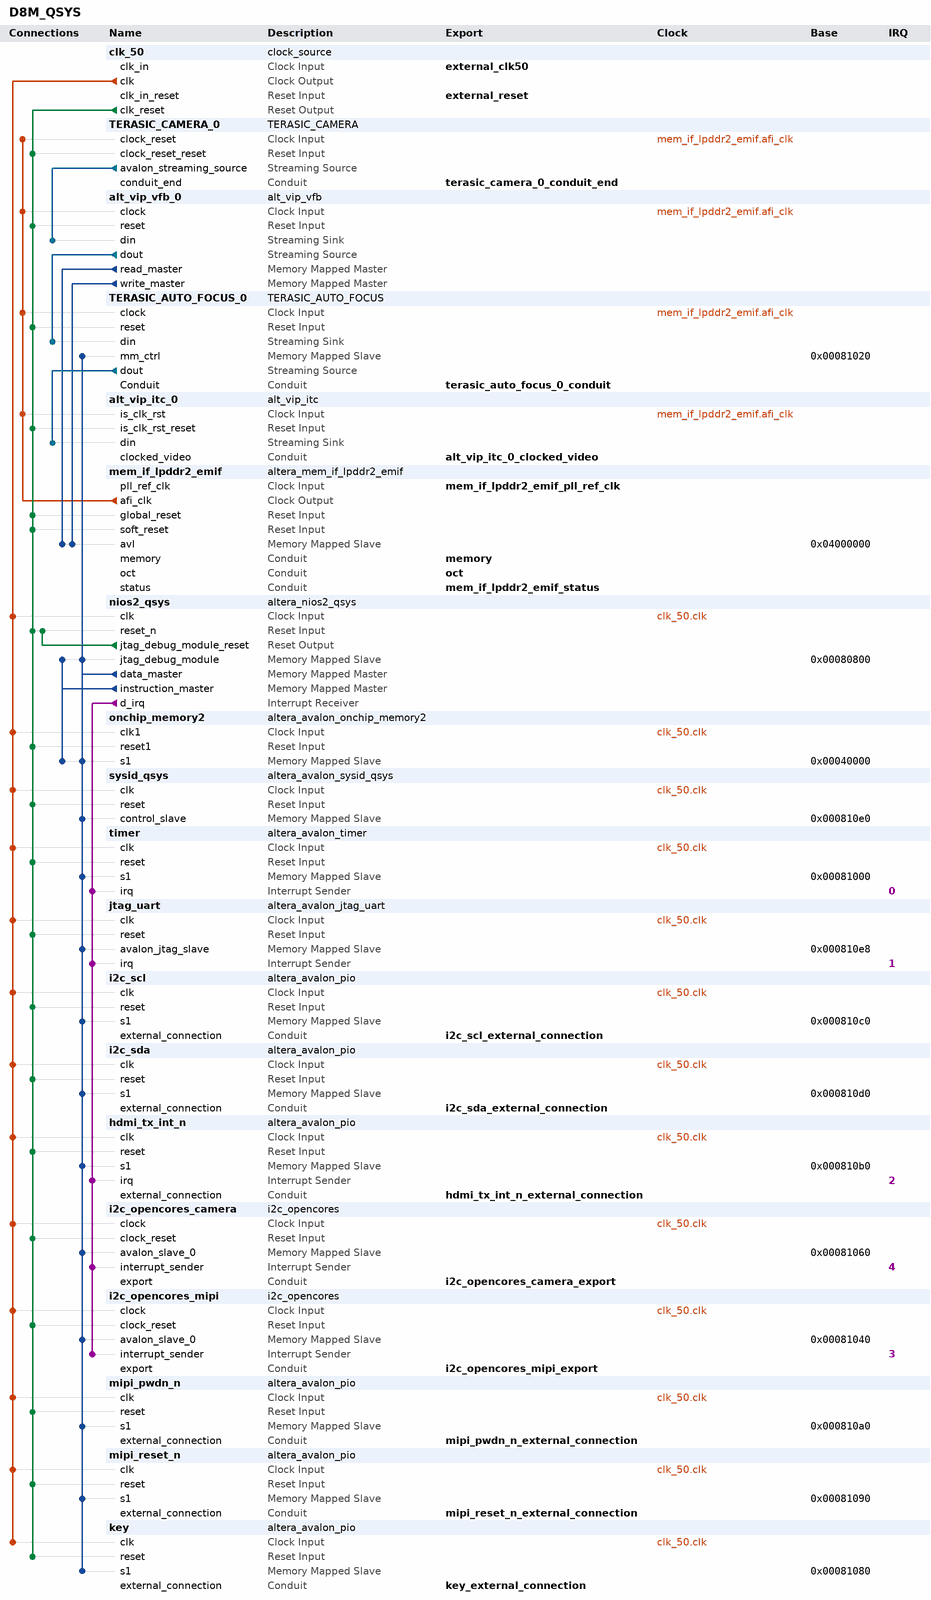
[diagram p0: system contents]
# Platform Designer (Qsys) system D8M_QSYS, Cyclone V 5CGXFC5C6F27C7
# Parameters at their usual value, and those the tool derives, are not listed.
package require -exact qsys 15.0
create_system D8M_QSYS
set_project_property DEVICE_FAMILY {Cyclone V}
set_project_property DEVICE 5CGXFC5C6F27C7

add_instance clk_50 clock_source 15.0
set_instance_parameter_value clk_50 clockFrequency 50000000

add_instance TERASIC_CAMERA_0 TERASIC_CAMERA 1.0
set_instance_parameter_value TERASIC_CAMERA_0 VIDEO_H 1080
set_instance_parameter_value TERASIC_CAMERA_0 VIDEO_W 1920

add_instance alt_vip_vfb_0 alt_vip_vfb 13.1

add_instance TERASIC_AUTO_FOCUS_0 TERASIC_AUTO_FOCUS 1.0
set_instance_parameter_value TERASIC_AUTO_FOCUS_0 VIDEO_H 1080
set_instance_parameter_value TERASIC_AUTO_FOCUS_0 VIDEO_W 1920

add_instance alt_vip_itc_0 alt_vip_itc 14.0
set_instance_parameter_value alt_vip_itc_0 FIFO_DEPTH 3840
set_instance_parameter_value alt_vip_itc_0 H_ACTIVE_PIXELS 1920
set_instance_parameter_value alt_vip_itc_0 H_BACK_PORCH 148
set_instance_parameter_value alt_vip_itc_0 H_FRONT_PORCH 88
set_instance_parameter_value alt_vip_itc_0 H_SYNC_LENGTH 44
set_instance_parameter_value alt_vip_itc_0 NUMBER_OF_COLOUR_PLANES 3
set_instance_parameter_value alt_vip_itc_0 THRESHOLD 1919
set_instance_parameter_value alt_vip_itc_0 V_ACTIVE_LINES 1080
set_instance_parameter_value alt_vip_itc_0 V_BACK_PORCH 36
set_instance_parameter_value alt_vip_itc_0 V_FRONT_PORCH 4
set_instance_parameter_value alt_vip_itc_0 V_SYNC_LENGTH 5

add_instance mem_if_lpddr2_emif altera_mem_if_lpddr2_emif 15.0
set_instance_parameter_value mem_if_lpddr2_emif ABSTRACT_REAL_COMPARE_TEST false
set_instance_parameter_value mem_if_lpddr2_emif ABS_RAM_MEM_INIT_FILENAME meminit
set_instance_parameter_value mem_if_lpddr2_emif ACV_PHY_CLK_ADD_FR_PHASE 0.0
set_instance_parameter_value mem_if_lpddr2_emif AC_PACKAGE_DESKEW false
set_instance_parameter_value mem_if_lpddr2_emif AC_ROM_USER_ADD_0 0_0000_0000_0000
set_instance_parameter_value mem_if_lpddr2_emif AC_ROM_USER_ADD_1 0_0000_0000_1000
set_instance_parameter_value mem_if_lpddr2_emif ADDR_ORDER 0
set_instance_parameter_value mem_if_lpddr2_emif ADD_EFFICIENCY_MONITOR false
set_instance_parameter_value mem_if_lpddr2_emif ADD_EXTERNAL_SEQ_DEBUG_NIOS false
set_instance_parameter_value mem_if_lpddr2_emif ADVANCED_CK_PHASES false
set_instance_parameter_value mem_if_lpddr2_emif ADVERTIZE_SEQUENCER_SW_BUILD_FILES false
set_instance_parameter_value mem_if_lpddr2_emif AFI_DEBUG_INFO_WIDTH 32
set_instance_parameter_value mem_if_lpddr2_emif ALTMEMPHY_COMPATIBLE_MODE false
set_instance_parameter_value mem_if_lpddr2_emif AP_MODE false
set_instance_parameter_value mem_if_lpddr2_emif AP_MODE_EN 0
set_instance_parameter_value mem_if_lpddr2_emif AVL_DATA_WIDTH_PORT 32,32,32,32,32,32
set_instance_parameter_value mem_if_lpddr2_emif AVL_MAX_SIZE 32
set_instance_parameter_value mem_if_lpddr2_emif BYTE_ENABLE true
set_instance_parameter_value mem_if_lpddr2_emif C2P_WRITE_CLOCK_ADD_PHASE 0.0
set_instance_parameter_value mem_if_lpddr2_emif CALIBRATION_MODE Skip
set_instance_parameter_value mem_if_lpddr2_emif CALIB_REG_WIDTH 8
set_instance_parameter_value mem_if_lpddr2_emif CFG_DATA_REORDERING_TYPE INTER_BANK
set_instance_parameter_value mem_if_lpddr2_emif CFG_REORDER_DATA true
set_instance_parameter_value mem_if_lpddr2_emif CFG_TCCD_NS 2.5
set_instance_parameter_value mem_if_lpddr2_emif COMMAND_PHASE 0.0
set_instance_parameter_value mem_if_lpddr2_emif CONTROLLER_LATENCY 5
set_instance_parameter_value mem_if_lpddr2_emif CORE_DEBUG_CONNECTION EXPORT
set_instance_parameter_value mem_if_lpddr2_emif CPORT_TYPE_PORT Write-only,Read-only,Bidirectional,Bidirectional,Bidirectional,Bidirectional
set_instance_parameter_value mem_if_lpddr2_emif CTL_AUTOPCH_EN false
set_instance_parameter_value mem_if_lpddr2_emif CTL_CMD_QUEUE_DEPTH 8
set_instance_parameter_value mem_if_lpddr2_emif CTL_CSR_CONNECTION INTERNAL_JTAG
set_instance_parameter_value mem_if_lpddr2_emif CTL_CSR_ENABLED false
set_instance_parameter_value mem_if_lpddr2_emif CTL_CSR_READ_ONLY 1
set_instance_parameter_value mem_if_lpddr2_emif CTL_DEEP_POWERDN_EN false
set_instance_parameter_value mem_if_lpddr2_emif CTL_DYNAMIC_BANK_ALLOCATION false
set_instance_parameter_value mem_if_lpddr2_emif CTL_DYNAMIC_BANK_NUM 4
set_instance_parameter_value mem_if_lpddr2_emif CTL_ECC_AUTO_CORRECTION_ENABLED false
set_instance_parameter_value mem_if_lpddr2_emif CTL_ECC_ENABLED false
set_instance_parameter_value mem_if_lpddr2_emif CTL_ENABLE_BURST_INTERRUPT false
set_instance_parameter_value mem_if_lpddr2_emif CTL_ENABLE_BURST_TERMINATE false
set_instance_parameter_value mem_if_lpddr2_emif CTL_HRB_ENABLED false
set_instance_parameter_value mem_if_lpddr2_emif CTL_LOOK_AHEAD_DEPTH 4
set_instance_parameter_value mem_if_lpddr2_emif CTL_SELF_REFRESH_EN false
set_instance_parameter_value mem_if_lpddr2_emif CTL_USR_REFRESH_EN false
set_instance_parameter_value mem_if_lpddr2_emif CTL_ZQCAL_EN false
set_instance_parameter_value mem_if_lpddr2_emif CUT_NEW_FAMILY_TIMING true
set_instance_parameter_value mem_if_lpddr2_emif DAT_DATA_WIDTH 32
set_instance_parameter_value mem_if_lpddr2_emif DEBUG_MODE false
set_instance_parameter_value mem_if_lpddr2_emif DEVICE_DEPTH 1
set_instance_parameter_value mem_if_lpddr2_emif DISABLE_CHILD_MESSAGING false
set_instance_parameter_value mem_if_lpddr2_emif DISCRETE_FLY_BY true
set_instance_parameter_value mem_if_lpddr2_emif DLL_SHARING_MODE None
set_instance_parameter_value mem_if_lpddr2_emif DQS_DQSN_MODE DIFFERENTIAL
set_instance_parameter_value mem_if_lpddr2_emif DQ_INPUT_REG_USE_CLKN false
set_instance_parameter_value mem_if_lpddr2_emif DUPLICATE_AC false
set_instance_parameter_value mem_if_lpddr2_emif ED_EXPORT_SEQ_DEBUG false
set_instance_parameter_value mem_if_lpddr2_emif ENABLE_ABS_RAM_MEM_INIT false
set_instance_parameter_value mem_if_lpddr2_emif ENABLE_BONDING false
set_instance_parameter_value mem_if_lpddr2_emif ENABLE_BURST_MERGE false
set_instance_parameter_value mem_if_lpddr2_emif ENABLE_CTRL_AVALON_INTERFACE true
set_instance_parameter_value mem_if_lpddr2_emif ENABLE_DELAY_CHAIN_WRITE false
set_instance_parameter_value mem_if_lpddr2_emif ENABLE_EMIT_BFM_MASTER false
set_instance_parameter_value mem_if_lpddr2_emif ENABLE_EXPORT_SEQ_DEBUG_BRIDGE false
set_instance_parameter_value mem_if_lpddr2_emif ENABLE_EXTRA_REPORTING false
set_instance_parameter_value mem_if_lpddr2_emif ENABLE_ISS_PROBES false
set_instance_parameter_value mem_if_lpddr2_emif ENABLE_NON_DESTRUCTIVE_CALIB false
set_instance_parameter_value mem_if_lpddr2_emif ENABLE_NON_DES_CAL false
set_instance_parameter_value mem_if_lpddr2_emif ENABLE_NON_DES_CAL_TEST false
set_instance_parameter_value mem_if_lpddr2_emif ENABLE_SEQUENCER_MARGINING_ON_BY_DEFAULT false
set_instance_parameter_value mem_if_lpddr2_emif ENABLE_USER_ECC false
set_instance_parameter_value mem_if_lpddr2_emif EXPORT_AFI_HALF_CLK false
set_instance_parameter_value mem_if_lpddr2_emif FORCED_NON_LDC_ADDR_CMD_MEM_CK_INVERT false
set_instance_parameter_value mem_if_lpddr2_emif FORCED_NUM_WRITE_FR_CYCLE_SHIFTS 0
set_instance_parameter_value mem_if_lpddr2_emif FORCE_DQS_TRACKING AUTO
set_instance_parameter_value mem_if_lpddr2_emif FORCE_MAX_LATENCY_COUNT_WIDTH 0
set_instance_parameter_value mem_if_lpddr2_emif FORCE_SEQUENCER_TCL_DEBUG_MODE false
set_instance_parameter_value mem_if_lpddr2_emif FORCE_SHADOW_REGS AUTO
set_instance_parameter_value mem_if_lpddr2_emif HARD_EMIF false
set_instance_parameter_value mem_if_lpddr2_emif HCX_COMPAT_MODE false
set_instance_parameter_value mem_if_lpddr2_emif HHP_HPS false
set_instance_parameter_value mem_if_lpddr2_emif HHP_HPS_SIMULATION false
set_instance_parameter_value mem_if_lpddr2_emif HHP_HPS_VERIFICATION false
set_instance_parameter_value mem_if_lpddr2_emif HPS_PROTOCOL DEFAULT
set_instance_parameter_value mem_if_lpddr2_emif INCLUDE_BOARD_DELAY_MODEL false
set_instance_parameter_value mem_if_lpddr2_emif INCLUDE_MULTIRANK_BOARD_DELAY_MODEL false
set_instance_parameter_value mem_if_lpddr2_emif IS_ES_DEVICE false
set_instance_parameter_value mem_if_lpddr2_emif LOCAL_ID_WIDTH 8
set_instance_parameter_value mem_if_lpddr2_emif MARGIN_VARIATION_TEST false
set_instance_parameter_value mem_if_lpddr2_emif MAX_PENDING_RD_CMD 16
set_instance_parameter_value mem_if_lpddr2_emif MAX_PENDING_WR_CMD 8
set_instance_parameter_value mem_if_lpddr2_emif MEM_ATCL 0
set_instance_parameter_value mem_if_lpddr2_emif MEM_AUTO_LEVELING_MODE true
set_instance_parameter_value mem_if_lpddr2_emif MEM_BANKADDR_WIDTH 2
set_instance_parameter_value mem_if_lpddr2_emif MEM_BL 8
set_instance_parameter_value mem_if_lpddr2_emif MEM_BT Sequential
set_instance_parameter_value mem_if_lpddr2_emif MEM_CK_PHASE 0.0
set_instance_parameter_value mem_if_lpddr2_emif MEM_CK_WIDTH 1
set_instance_parameter_value mem_if_lpddr2_emif MEM_CLK_EN_WIDTH 1
set_instance_parameter_value mem_if_lpddr2_emif MEM_CLK_FREQ 300.0
set_instance_parameter_value mem_if_lpddr2_emif MEM_CLK_FREQ_MAX 400.0
set_instance_parameter_value mem_if_lpddr2_emif MEM_COL_ADDR_WIDTH 9
set_instance_parameter_value mem_if_lpddr2_emif MEM_CS_WIDTH 1
set_instance_parameter_value mem_if_lpddr2_emif MEM_DEVICE MISSING_MODEL
set_instance_parameter_value mem_if_lpddr2_emif MEM_DLL_EN true
set_instance_parameter_value mem_if_lpddr2_emif MEM_DQ_PER_DQS 8
set_instance_parameter_value mem_if_lpddr2_emif MEM_DQ_WIDTH 32
set_instance_parameter_value mem_if_lpddr2_emif MEM_DRV_STR 40
set_instance_parameter_value mem_if_lpddr2_emif MEM_FORMAT DISCRETE
set_instance_parameter_value mem_if_lpddr2_emif MEM_GUARANTEED_WRITE_INIT false
set_instance_parameter_value mem_if_lpddr2_emif MEM_IF_BOARD_BASE_DELAY 10
set_instance_parameter_value mem_if_lpddr2_emif MEM_IF_DM_PINS_EN true
set_instance_parameter_value mem_if_lpddr2_emif MEM_IF_DQSN_EN true
set_instance_parameter_value mem_if_lpddr2_emif MEM_IF_SIM_VALID_WINDOW 0
set_instance_parameter_value mem_if_lpddr2_emif MEM_INIT_EN false
set_instance_parameter_value mem_if_lpddr2_emif MEM_MIRROR_ADDRESSING 0
set_instance_parameter_value mem_if_lpddr2_emif MEM_NUMBER_OF_DIMMS 1
set_instance_parameter_value mem_if_lpddr2_emif MEM_NUMBER_OF_RANKS_PER_DEVICE 1
set_instance_parameter_value mem_if_lpddr2_emif MEM_NUMBER_OF_RANKS_PER_DIMM 1
set_instance_parameter_value mem_if_lpddr2_emif MEM_RANK_MULTIPLICATION_FACTOR 1
set_instance_parameter_value mem_if_lpddr2_emif MEM_ROW_ADDR_WIDTH 13
set_instance_parameter_value mem_if_lpddr2_emif MEM_TCL 7
set_instance_parameter_value mem_if_lpddr2_emif MEM_TFAW_NS 50.0
set_instance_parameter_value mem_if_lpddr2_emif MEM_TINIT_US 200
set_instance_parameter_value mem_if_lpddr2_emif MEM_TMRD_CK 5
set_instance_parameter_value mem_if_lpddr2_emif MEM_TRAS_NS 70.0
set_instance_parameter_value mem_if_lpddr2_emif MEM_TRCD_NS 18.0
set_instance_parameter_value mem_if_lpddr2_emif MEM_TREFI_US 7.8
set_instance_parameter_value mem_if_lpddr2_emif MEM_TRFC_NS 130.0
set_instance_parameter_value mem_if_lpddr2_emif MEM_TRP_NS 18.0
set_instance_parameter_value mem_if_lpddr2_emif MEM_TRRD_NS 10.0
set_instance_parameter_value mem_if_lpddr2_emif MEM_TRTP_NS 7.5
set_instance_parameter_value mem_if_lpddr2_emif MEM_TWR_NS 15.0
set_instance_parameter_value mem_if_lpddr2_emif MEM_TWTR 3
set_instance_parameter_value mem_if_lpddr2_emif MEM_USER_LEVELING_MODE Leveling
set_instance_parameter_value mem_if_lpddr2_emif MEM_VENDOR Micron
set_instance_parameter_value mem_if_lpddr2_emif MEM_VERBOSE true
set_instance_parameter_value mem_if_lpddr2_emif MRS_MIRROR_PING_PONG_ATSO false
set_instance_parameter_value mem_if_lpddr2_emif MULTICAST_EN false
set_instance_parameter_value mem_if_lpddr2_emif NEXTGEN true
set_instance_parameter_value mem_if_lpddr2_emif NIOS_ROM_DATA_WIDTH 32
set_instance_parameter_value mem_if_lpddr2_emif NUM_DLL_SHARING_INTERFACES 1
set_instance_parameter_value mem_if_lpddr2_emif NUM_EXTRA_REPORT_PATH 10
set_instance_parameter_value mem_if_lpddr2_emif NUM_OCT_SHARING_INTERFACES 1
set_instance_parameter_value mem_if_lpddr2_emif NUM_OF_PORTS 1
set_instance_parameter_value mem_if_lpddr2_emif NUM_PLL_SHARING_INTERFACES 1
set_instance_parameter_value mem_if_lpddr2_emif OCT_SHARING_MODE None
set_instance_parameter_value mem_if_lpddr2_emif P2C_READ_CLOCK_ADD_PHASE 0.0
set_instance_parameter_value mem_if_lpddr2_emif PACKAGE_DESKEW false
set_instance_parameter_value mem_if_lpddr2_emif PARSE_FRIENDLY_DEVICE_FAMILY_PARAM_VALID false
set_instance_parameter_value mem_if_lpddr2_emif PHY_CSR_CONNECTION INTERNAL_JTAG
set_instance_parameter_value mem_if_lpddr2_emif PHY_CSR_ENABLED false
set_instance_parameter_value mem_if_lpddr2_emif PHY_ONLY false
set_instance_parameter_value mem_if_lpddr2_emif PINGPONGPHY_EN false
set_instance_parameter_value mem_if_lpddr2_emif PLL_ADDR_CMD_CLK_DIV_PARAM 0
set_instance_parameter_value mem_if_lpddr2_emif PLL_ADDR_CMD_CLK_FREQ_PARAM 0.0
set_instance_parameter_value mem_if_lpddr2_emif PLL_ADDR_CMD_CLK_MULT_PARAM 0
set_instance_parameter_value mem_if_lpddr2_emif PLL_ADDR_CMD_CLK_PHASE_PS_PARAM 0
set_instance_parameter_value mem_if_lpddr2_emif PLL_AFI_CLK_DIV_PARAM 0
set_instance_parameter_value mem_if_lpddr2_emif PLL_AFI_CLK_FREQ_PARAM 0.0
set_instance_parameter_value mem_if_lpddr2_emif PLL_AFI_CLK_MULT_PARAM 0
set_instance_parameter_value mem_if_lpddr2_emif PLL_AFI_CLK_PHASE_PS_PARAM 0
set_instance_parameter_value mem_if_lpddr2_emif PLL_AFI_HALF_CLK_DIV_PARAM 0
set_instance_parameter_value mem_if_lpddr2_emif PLL_AFI_HALF_CLK_FREQ_PARAM 0.0
set_instance_parameter_value mem_if_lpddr2_emif PLL_AFI_HALF_CLK_MULT_PARAM 0
set_instance_parameter_value mem_if_lpddr2_emif PLL_AFI_HALF_CLK_PHASE_PS_PARAM 0
set_instance_parameter_value mem_if_lpddr2_emif PLL_AFI_PHY_CLK_DIV_PARAM 0
set_instance_parameter_value mem_if_lpddr2_emif PLL_AFI_PHY_CLK_FREQ_PARAM 0.0
set_instance_parameter_value mem_if_lpddr2_emif PLL_AFI_PHY_CLK_MULT_PARAM 0
set_instance_parameter_value mem_if_lpddr2_emif PLL_AFI_PHY_CLK_PHASE_PS_PARAM 0
set_instance_parameter_value mem_if_lpddr2_emif PLL_C2P_WRITE_CLK_DIV_PARAM 0
set_instance_parameter_value mem_if_lpddr2_emif PLL_C2P_WRITE_CLK_FREQ_PARAM 0.0
set_instance_parameter_value mem_if_lpddr2_emif PLL_C2P_WRITE_CLK_MULT_PARAM 0
set_instance_parameter_value mem_if_lpddr2_emif PLL_C2P_WRITE_CLK_PHASE_PS_PARAM 0
set_instance_parameter_value mem_if_lpddr2_emif PLL_CLK_PARAM_VALID false
set_instance_parameter_value mem_if_lpddr2_emif PLL_CONFIG_CLK_DIV_PARAM 0
set_instance_parameter_value mem_if_lpddr2_emif PLL_CONFIG_CLK_FREQ_PARAM 0.0
set_instance_parameter_value mem_if_lpddr2_emif PLL_CONFIG_CLK_MULT_PARAM 0
set_instance_parameter_value mem_if_lpddr2_emif PLL_CONFIG_CLK_PHASE_PS_PARAM 0
set_instance_parameter_value mem_if_lpddr2_emif PLL_DR_CLK_DIV_PARAM 0
set_instance_parameter_value mem_if_lpddr2_emif PLL_DR_CLK_FREQ_PARAM 0.0
set_instance_parameter_value mem_if_lpddr2_emif PLL_DR_CLK_MULT_PARAM 0
set_instance_parameter_value mem_if_lpddr2_emif PLL_DR_CLK_PHASE_PS_PARAM 0
set_instance_parameter_value mem_if_lpddr2_emif PLL_HR_CLK_DIV_PARAM 0
set_instance_parameter_value mem_if_lpddr2_emif PLL_HR_CLK_FREQ_PARAM 0.0
set_instance_parameter_value mem_if_lpddr2_emif PLL_HR_CLK_MULT_PARAM 0
set_instance_parameter_value mem_if_lpddr2_emif PLL_HR_CLK_PHASE_PS_PARAM 0
set_instance_parameter_value mem_if_lpddr2_emif PLL_LOCATION Top_Bottom
set_instance_parameter_value mem_if_lpddr2_emif PLL_MEM_CLK_DIV_PARAM 0
set_instance_parameter_value mem_if_lpddr2_emif PLL_MEM_CLK_FREQ_PARAM 0.0
set_instance_parameter_value mem_if_lpddr2_emif PLL_MEM_CLK_MULT_PARAM 0
set_instance_parameter_value mem_if_lpddr2_emif PLL_MEM_CLK_PHASE_PS_PARAM 0
set_instance_parameter_value mem_if_lpddr2_emif PLL_NIOS_CLK_DIV_PARAM 0
set_instance_parameter_value mem_if_lpddr2_emif PLL_NIOS_CLK_FREQ_PARAM 0.0
set_instance_parameter_value mem_if_lpddr2_emif PLL_NIOS_CLK_MULT_PARAM 0
set_instance_parameter_value mem_if_lpddr2_emif PLL_NIOS_CLK_PHASE_PS_PARAM 0
set_instance_parameter_value mem_if_lpddr2_emif PLL_P2C_READ_CLK_DIV_PARAM 0
set_instance_parameter_value mem_if_lpddr2_emif PLL_P2C_READ_CLK_FREQ_PARAM 0.0
set_instance_parameter_value mem_if_lpddr2_emif PLL_P2C_READ_CLK_MULT_PARAM 0
set_instance_parameter_value mem_if_lpddr2_emif PLL_P2C_READ_CLK_PHASE_PS_PARAM 0
set_instance_parameter_value mem_if_lpddr2_emif PLL_SHARING_MODE None
set_instance_parameter_value mem_if_lpddr2_emif PLL_WRITE_CLK_DIV_PARAM 0
set_instance_parameter_value mem_if_lpddr2_emif PLL_WRITE_CLK_FREQ_PARAM 0.0
set_instance_parameter_value mem_if_lpddr2_emif PLL_WRITE_CLK_MULT_PARAM 0
set_instance_parameter_value mem_if_lpddr2_emif PLL_WRITE_CLK_PHASE_PS_PARAM 0
set_instance_parameter_value mem_if_lpddr2_emif POWER_OF_TWO_BUS false
set_instance_parameter_value mem_if_lpddr2_emif PRIORITY_PORT 1,1,1,1,1,1
set_instance_parameter_value mem_if_lpddr2_emif RATE Half
set_instance_parameter_value mem_if_lpddr2_emif READ_DQ_DQS_CLOCK_SOURCE INVERTED_DQS_BUS
set_instance_parameter_value mem_if_lpddr2_emif READ_FIFO_SIZE 8
set_instance_parameter_value mem_if_lpddr2_emif REFRESH_BURST_VALIDATION false
set_instance_parameter_value mem_if_lpddr2_emif REFRESH_INTERVAL 15000
set_instance_parameter_value mem_if_lpddr2_emif REF_CLK_FREQ 125.0
set_instance_parameter_value mem_if_lpddr2_emif REF_CLK_FREQ_MAX_PARAM 0.0
set_instance_parameter_value mem_if_lpddr2_emif REF_CLK_FREQ_MIN_PARAM 0.0
set_instance_parameter_value mem_if_lpddr2_emif REF_CLK_FREQ_PARAM_VALID false
set_instance_parameter_value mem_if_lpddr2_emif SEQUENCER_TYPE NIOS
set_instance_parameter_value mem_if_lpddr2_emif SEQ_MODE 0
set_instance_parameter_value mem_if_lpddr2_emif SKIP_MEM_INIT true
set_instance_parameter_value mem_if_lpddr2_emif SOPC_COMPAT_RESET false
set_instance_parameter_value mem_if_lpddr2_emif SPEED_GRADE 7
set_instance_parameter_value mem_if_lpddr2_emif STARVE_LIMIT 10
set_instance_parameter_value mem_if_lpddr2_emif TIMING_BOARD_AC_EYE_REDUCTION_H 0.0
set_instance_parameter_value mem_if_lpddr2_emif TIMING_BOARD_AC_EYE_REDUCTION_SU 0.0
set_instance_parameter_value mem_if_lpddr2_emif TIMING_BOARD_AC_SKEW 0.02
set_instance_parameter_value mem_if_lpddr2_emif TIMING_BOARD_AC_SLEW_RATE 1.0
set_instance_parameter_value mem_if_lpddr2_emif TIMING_BOARD_AC_TO_CK_SKEW 0.0
set_instance_parameter_value mem_if_lpddr2_emif TIMING_BOARD_CK_CKN_SLEW_RATE 2.0
set_instance_parameter_value mem_if_lpddr2_emif TIMING_BOARD_DELTA_DQS_ARRIVAL_TIME 0.0
set_instance_parameter_value mem_if_lpddr2_emif TIMING_BOARD_DELTA_READ_DQS_ARRIVAL_TIME 0.0
set_instance_parameter_value mem_if_lpddr2_emif TIMING_BOARD_DERATE_METHOD AUTO
set_instance_parameter_value mem_if_lpddr2_emif TIMING_BOARD_DQS_DQSN_SLEW_RATE 2.0
set_instance_parameter_value mem_if_lpddr2_emif TIMING_BOARD_DQ_EYE_REDUCTION 0.0
set_instance_parameter_value mem_if_lpddr2_emif TIMING_BOARD_DQ_SLEW_RATE 1.0
set_instance_parameter_value mem_if_lpddr2_emif TIMING_BOARD_DQ_TO_DQS_SKEW 0.0
set_instance_parameter_value mem_if_lpddr2_emif TIMING_BOARD_ISI_METHOD AUTO
set_instance_parameter_value mem_if_lpddr2_emif TIMING_BOARD_MAX_CK_DELAY 0.33
set_instance_parameter_value mem_if_lpddr2_emif TIMING_BOARD_MAX_DQS_DELAY 0.34
set_instance_parameter_value mem_if_lpddr2_emif TIMING_BOARD_READ_DQ_EYE_REDUCTION 0.0
set_instance_parameter_value mem_if_lpddr2_emif TIMING_BOARD_SKEW_BETWEEN_DIMMS 0.05
set_instance_parameter_value mem_if_lpddr2_emif TIMING_BOARD_SKEW_BETWEEN_DQS 0.02
set_instance_parameter_value mem_if_lpddr2_emif TIMING_BOARD_SKEW_CKDQS_DIMM_MAX 0.01
set_instance_parameter_value mem_if_lpddr2_emif TIMING_BOARD_SKEW_CKDQS_DIMM_MIN -0.01
set_instance_parameter_value mem_if_lpddr2_emif TIMING_BOARD_SKEW_WITHIN_DQS 0.02
set_instance_parameter_value mem_if_lpddr2_emif TIMING_BOARD_TDH 0.0
set_instance_parameter_value mem_if_lpddr2_emif TIMING_BOARD_TDS 0.0
set_instance_parameter_value mem_if_lpddr2_emif TIMING_BOARD_TIH 0.0
set_instance_parameter_value mem_if_lpddr2_emif TIMING_BOARD_TIS 0.0
set_instance_parameter_value mem_if_lpddr2_emif TIMING_TDH 270
set_instance_parameter_value mem_if_lpddr2_emif TIMING_TDQSCK 5500
set_instance_parameter_value mem_if_lpddr2_emif TIMING_TDQSCKDL 1200
set_instance_parameter_value mem_if_lpddr2_emif TIMING_TDQSCKDM 900
set_instance_parameter_value mem_if_lpddr2_emif TIMING_TDQSCKDS 450
set_instance_parameter_value mem_if_lpddr2_emif TIMING_TDQSH 0.4
set_instance_parameter_value mem_if_lpddr2_emif TIMING_TDQSQ 240
set_instance_parameter_value mem_if_lpddr2_emif TIMING_TDQSS 1.0
set_instance_parameter_value mem_if_lpddr2_emif TIMING_TDS 270
set_instance_parameter_value mem_if_lpddr2_emif TIMING_TDSH 0.2
set_instance_parameter_value mem_if_lpddr2_emif TIMING_TDSS 0.2
set_instance_parameter_value mem_if_lpddr2_emif TIMING_TIH 290
set_instance_parameter_value mem_if_lpddr2_emif TIMING_TIS 290
set_instance_parameter_value mem_if_lpddr2_emif TIMING_TQHS 280
set_instance_parameter_value mem_if_lpddr2_emif TRACKING_ERROR_TEST false
set_instance_parameter_value mem_if_lpddr2_emif TRACKING_WATCH_TEST false
set_instance_parameter_value mem_if_lpddr2_emif TREFI 35100
set_instance_parameter_value mem_if_lpddr2_emif TRFC 350
set_instance_parameter_value mem_if_lpddr2_emif USER_DEBUG_LEVEL 1
set_instance_parameter_value mem_if_lpddr2_emif USE_AXI_ADAPTOR false
set_instance_parameter_value mem_if_lpddr2_emif USE_FAKE_PHY false
set_instance_parameter_value mem_if_lpddr2_emif USE_MEM_CLK_FREQ false
set_instance_parameter_value mem_if_lpddr2_emif USE_MM_ADAPTOR true
set_instance_parameter_value mem_if_lpddr2_emif USE_SEQUENCER_BFM false
set_instance_parameter_value mem_if_lpddr2_emif WEIGHT_PORT 0,0,0,0,0,0
set_instance_parameter_value mem_if_lpddr2_emif WRBUFFER_ADDR_WIDTH 6

add_instance nios2_qsys altera_nios2_qsys 15.0
set_instance_parameter_value nios2_qsys breakSlave nios2_qsys.jtag_debug_module
set_instance_parameter_value nios2_qsys exceptionSlave onchip_memory2.s1
set_instance_parameter_value nios2_qsys icache_size 4096
set_instance_parameter_value nios2_qsys impl Fast
set_instance_parameter_value nios2_qsys mmu_TLBMissExcSlave None
set_instance_parameter_value nios2_qsys resetSlave onchip_memory2.s1
set_instance_parameter_value nios2_qsys resetrequest_enabled true

add_instance onchip_memory2 altera_avalon_onchip_memory2 15.0
set_instance_parameter_value onchip_memory2 dataWidth 32
set_instance_parameter_value onchip_memory2 dualPort false
set_instance_parameter_value onchip_memory2 initMemContent true
set_instance_parameter_value onchip_memory2 initializationFileName onchip_mem.hex
set_instance_parameter_value onchip_memory2 memorySize 180000

add_instance sysid_qsys altera_avalon_sysid_qsys 15.0
set_instance_parameter_value sysid_qsys id 0

add_instance timer altera_avalon_timer 15.0
set_instance_parameter_value timer period 1
set_instance_parameter_value timer periodUnits MSEC

add_instance jtag_uart altera_avalon_jtag_uart 15.0
set_instance_parameter_value jtag_uart simInteractiveOptions NO_INTERACTIVE_WINDOWS

add_instance i2c_scl altera_avalon_pio 15.0
set_instance_parameter_value i2c_scl direction Output
set_instance_parameter_value i2c_scl resetValue 1
set_instance_parameter_value i2c_scl width 1

add_instance i2c_sda altera_avalon_pio 15.0
set_instance_parameter_value i2c_sda direction Bidir
set_instance_parameter_value i2c_sda width 1

add_instance hdmi_tx_int_n altera_avalon_pio 15.0
set_instance_parameter_value hdmi_tx_int_n direction Input
set_instance_parameter_value hdmi_tx_int_n generateIRQ true
set_instance_parameter_value hdmi_tx_int_n width 1

add_instance i2c_opencores_camera i2c_opencores 12.0

add_instance i2c_opencores_mipi i2c_opencores 12.0

add_instance mipi_pwdn_n altera_avalon_pio 15.0
set_instance_parameter_value mipi_pwdn_n direction Output
set_instance_parameter_value mipi_pwdn_n width 1

add_instance mipi_reset_n altera_avalon_pio 15.0
set_instance_parameter_value mipi_reset_n direction Output
set_instance_parameter_value mipi_reset_n width 1

add_instance key altera_avalon_pio 15.0
set_instance_parameter_value key direction Input
set_instance_parameter_value key width 4

# connections
add_connection clk_50.clk hdmi_tx_int_n.clk clock
add_connection clk_50.clk i2c_opencores_camera.clock clock
add_connection clk_50.clk i2c_opencores_mipi.clock clock
add_connection clk_50.clk i2c_scl.clk clock
add_connection clk_50.clk i2c_sda.clk clock
add_connection clk_50.clk jtag_uart.clk clock
add_connection clk_50.clk key.clk clock
add_connection clk_50.clk mipi_pwdn_n.clk clock
add_connection clk_50.clk mipi_reset_n.clk clock
add_connection clk_50.clk nios2_qsys.clk clock
add_connection clk_50.clk onchip_memory2.clk1 clock
add_connection clk_50.clk sysid_qsys.clk clock
add_connection clk_50.clk timer.clk clock
add_connection mem_if_lpddr2_emif.afi_clk alt_vip_itc_0.is_clk_rst clock
add_connection mem_if_lpddr2_emif.afi_clk alt_vip_vfb_0.clock clock
add_connection mem_if_lpddr2_emif.afi_clk TERASIC_AUTO_FOCUS_0.clock clock
add_connection mem_if_lpddr2_emif.afi_clk TERASIC_CAMERA_0.clock_reset clock
add_connection clk_50.clk_reset alt_vip_itc_0.is_clk_rst_reset reset
add_connection clk_50.clk_reset alt_vip_vfb_0.reset reset
add_connection clk_50.clk_reset hdmi_tx_int_n.reset reset
add_connection clk_50.clk_reset i2c_opencores_camera.clock_reset reset
add_connection clk_50.clk_reset i2c_opencores_mipi.clock_reset reset
add_connection clk_50.clk_reset i2c_scl.reset reset
add_connection clk_50.clk_reset i2c_sda.reset reset
add_connection clk_50.clk_reset jtag_uart.reset reset
add_connection clk_50.clk_reset key.reset reset
add_connection clk_50.clk_reset mem_if_lpddr2_emif.global_reset reset
add_connection clk_50.clk_reset mem_if_lpddr2_emif.soft_reset reset
add_connection clk_50.clk_reset mipi_pwdn_n.reset reset
add_connection clk_50.clk_reset mipi_reset_n.reset reset
add_connection clk_50.clk_reset nios2_qsys.reset_n reset
add_connection clk_50.clk_reset onchip_memory2.reset1 reset
add_connection clk_50.clk_reset sysid_qsys.reset reset
add_connection clk_50.clk_reset TERASIC_AUTO_FOCUS_0.reset reset
add_connection clk_50.clk_reset TERASIC_CAMERA_0.clock_reset_reset reset
add_connection clk_50.clk_reset timer.reset reset
add_connection nios2_qsys.jtag_debug_module_reset nios2_qsys.reset_n reset
add_connection alt_vip_vfb_0.read_master mem_if_lpddr2_emif.avl avalon
set_connection_parameter_value alt_vip_vfb_0.read_master/mem_if_lpddr2_emif.avl baseAddress 0x04000000
add_connection alt_vip_vfb_0.write_master mem_if_lpddr2_emif.avl avalon
set_connection_parameter_value alt_vip_vfb_0.write_master/mem_if_lpddr2_emif.avl baseAddress 0x04000000
add_connection nios2_qsys.data_master hdmi_tx_int_n.s1 avalon
set_connection_parameter_value nios2_qsys.data_master/hdmi_tx_int_n.s1 baseAddress 0x000810b0
add_connection nios2_qsys.data_master i2c_opencores_camera.avalon_slave_0 avalon
set_connection_parameter_value nios2_qsys.data_master/i2c_opencores_camera.avalon_slave_0 baseAddress 0x00081060
add_connection nios2_qsys.data_master i2c_opencores_mipi.avalon_slave_0 avalon
set_connection_parameter_value nios2_qsys.data_master/i2c_opencores_mipi.avalon_slave_0 baseAddress 0x00081040
add_connection nios2_qsys.data_master i2c_scl.s1 avalon
set_connection_parameter_value nios2_qsys.data_master/i2c_scl.s1 baseAddress 0x000810c0
add_connection nios2_qsys.data_master i2c_sda.s1 avalon
set_connection_parameter_value nios2_qsys.data_master/i2c_sda.s1 baseAddress 0x000810d0
add_connection nios2_qsys.data_master jtag_uart.avalon_jtag_slave avalon
set_connection_parameter_value nios2_qsys.data_master/jtag_uart.avalon_jtag_slave baseAddress 0x000810e8
add_connection nios2_qsys.data_master key.s1 avalon
set_connection_parameter_value nios2_qsys.data_master/key.s1 baseAddress 0x00081080
add_connection nios2_qsys.data_master mipi_pwdn_n.s1 avalon
set_connection_parameter_value nios2_qsys.data_master/mipi_pwdn_n.s1 baseAddress 0x000810a0
add_connection nios2_qsys.data_master mipi_reset_n.s1 avalon
set_connection_parameter_value nios2_qsys.data_master/mipi_reset_n.s1 baseAddress 0x00081090
add_connection nios2_qsys.data_master nios2_qsys.jtag_debug_module avalon
set_connection_parameter_value nios2_qsys.data_master/nios2_qsys.jtag_debug_module baseAddress 0x00080800
add_connection nios2_qsys.data_master onchip_memory2.s1 avalon
set_connection_parameter_value nios2_qsys.data_master/onchip_memory2.s1 baseAddress 0x00040000
add_connection nios2_qsys.data_master sysid_qsys.control_slave avalon
set_connection_parameter_value nios2_qsys.data_master/sysid_qsys.control_slave baseAddress 0x000810e0
add_connection nios2_qsys.data_master TERASIC_AUTO_FOCUS_0.mm_ctrl avalon
set_connection_parameter_value nios2_qsys.data_master/TERASIC_AUTO_FOCUS_0.mm_ctrl baseAddress 0x00081020
add_connection nios2_qsys.data_master timer.s1 avalon
set_connection_parameter_value nios2_qsys.data_master/timer.s1 baseAddress 0x00081000
add_connection nios2_qsys.instruction_master nios2_qsys.jtag_debug_module avalon
set_connection_parameter_value nios2_qsys.instruction_master/nios2_qsys.jtag_debug_module baseAddress 0x00080800
add_connection nios2_qsys.instruction_master onchip_memory2.s1 avalon
set_connection_parameter_value nios2_qsys.instruction_master/onchip_memory2.s1 baseAddress 0x00040000
add_connection alt_vip_vfb_0.dout TERASIC_AUTO_FOCUS_0.din avalon_streaming
add_connection TERASIC_AUTO_FOCUS_0.dout alt_vip_itc_0.din avalon_streaming
add_connection TERASIC_CAMERA_0.avalon_streaming_source alt_vip_vfb_0.din avalon_streaming
add_connection nios2_qsys.d_irq hdmi_tx_int_n.irq interrupt
set_connection_parameter_value nios2_qsys.d_irq/hdmi_tx_int_n.irq irqNumber 2
add_connection nios2_qsys.d_irq i2c_opencores_camera.interrupt_sender interrupt
set_connection_parameter_value nios2_qsys.d_irq/i2c_opencores_camera.interrupt_sender irqNumber 4
add_connection nios2_qsys.d_irq i2c_opencores_mipi.interrupt_sender interrupt
set_connection_parameter_value nios2_qsys.d_irq/i2c_opencores_mipi.interrupt_sender irqNumber 3
add_connection nios2_qsys.d_irq jtag_uart.irq interrupt
set_connection_parameter_value nios2_qsys.d_irq/jtag_uart.irq irqNumber 1
add_connection nios2_qsys.d_irq timer.irq interrupt
set_connection_parameter_value nios2_qsys.d_irq/timer.irq irqNumber 0

# exported interfaces
add_interface alt_vip_itc_0_clocked_video conduit end
set_interface_property alt_vip_itc_0_clocked_video EXPORT_OF alt_vip_itc_0.clocked_video
add_interface external_clk50 clock sink
set_interface_property external_clk50 EXPORT_OF clk_50.clk_in
add_interface external_reset reset sink
set_interface_property external_reset EXPORT_OF clk_50.clk_in_reset
add_interface hdmi_tx_int_n_external_connection conduit end
set_interface_property hdmi_tx_int_n_external_connection EXPORT_OF hdmi_tx_int_n.external_connection
add_interface i2c_opencores_camera_export conduit end
set_interface_property i2c_opencores_camera_export EXPORT_OF i2c_opencores_camera.export
add_interface i2c_opencores_mipi_export conduit end
set_interface_property i2c_opencores_mipi_export EXPORT_OF i2c_opencores_mipi.export
add_interface i2c_scl_external_connection conduit end
set_interface_property i2c_scl_external_connection EXPORT_OF i2c_scl.external_connection
add_interface i2c_sda_external_connection conduit end
set_interface_property i2c_sda_external_connection EXPORT_OF i2c_sda.external_connection
add_interface key_external_connection conduit end
set_interface_property key_external_connection EXPORT_OF key.external_connection
add_interface mem_if_lpddr2_emif_pll_ref_clk clock sink
set_interface_property mem_if_lpddr2_emif_pll_ref_clk EXPORT_OF mem_if_lpddr2_emif.pll_ref_clk
add_interface mem_if_lpddr2_emif_status conduit end
set_interface_property mem_if_lpddr2_emif_status EXPORT_OF mem_if_lpddr2_emif.status
add_interface memory conduit end
set_interface_property memory EXPORT_OF mem_if_lpddr2_emif.memory
add_interface mipi_pwdn_n_external_connection conduit end
set_interface_property mipi_pwdn_n_external_connection EXPORT_OF mipi_pwdn_n.external_connection
add_interface mipi_reset_n_external_connection conduit end
set_interface_property mipi_reset_n_external_connection EXPORT_OF mipi_reset_n.external_connection
add_interface oct conduit end
set_interface_property oct EXPORT_OF mem_if_lpddr2_emif.oct
add_interface terasic_auto_focus_0_conduit conduit end
set_interface_property terasic_auto_focus_0_conduit EXPORT_OF TERASIC_AUTO_FOCUS_0.Conduit
add_interface terasic_camera_0_conduit_end conduit end
set_interface_property terasic_camera_0_conduit_end EXPORT_OF TERASIC_CAMERA_0.conduit_end

set_interconnect_requirement {$system} qsys_mm.clockCrossingAdapter HANDSHAKE
set_interconnect_requirement {$system} qsys_mm.maxAdditionalLatency 1

save_system D8M_QSYS.qsys
